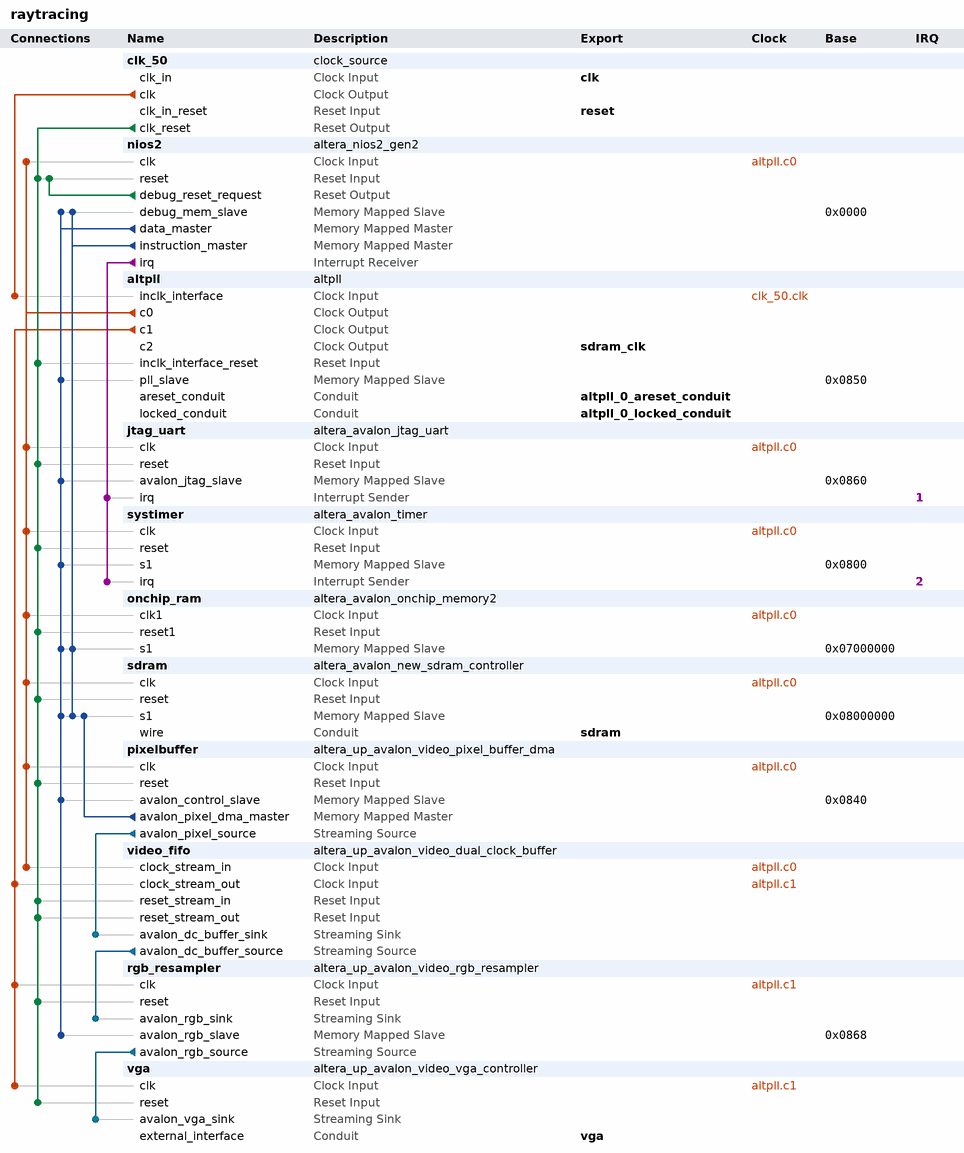
[diagram p0: system contents]
# Platform Designer (Qsys) system raytracing, Cyclone IV E EP4CE115F29C7
# Parameters at their usual value, and those the tool derives, are not listed.
package require -exact qsys 22.1
create_system raytracing
set_project_property DEVICE_FAMILY {Cyclone IV E}
set_project_property DEVICE EP4CE115F29C7

add_instance clk_50 clock_source 22.1
set_instance_parameter_value clk_50 clockFrequency 50000000

add_instance nios2 altera_nios2_gen2 22.1
set_instance_parameter_value nios2 dcache_size 16384
set_instance_parameter_value nios2 dividerType srt2
set_instance_parameter_value nios2 exceptionSlave onchip_ram.s1
set_instance_parameter_value nios2 icache_size 16384
set_instance_parameter_value nios2 impl Fast
set_instance_parameter_value nios2 resetSlave onchip_ram.s1

add_instance altpll altpll 22.1
set_instance_parameter_value altpll CLK0_DIVIDE_BY 1
set_instance_parameter_value altpll CLK0_MULTIPLY_BY 2
set_instance_parameter_value altpll CLK1_DIVIDE_BY 2
set_instance_parameter_value altpll CLK1_DUTY_CYCLE 50
set_instance_parameter_value altpll CLK1_MULTIPLY_BY 1
set_instance_parameter_value altpll CLK1_PHASE_SHIFT 0
set_instance_parameter_value altpll CLK2_DIVIDE_BY 1
set_instance_parameter_value altpll CLK2_DUTY_CYCLE 50
set_instance_parameter_value altpll CLK2_MULTIPLY_BY 2
set_instance_parameter_value altpll CLK2_PHASE_SHIFT -2500
set_instance_parameter_value altpll INCLK0_INPUT_FREQUENCY 20000
set_instance_parameter_value altpll PORT_ARESET PORT_USED
set_instance_parameter_value altpll PORT_LOCKED PORT_USED
set_instance_parameter_value altpll PORT_clk1 PORT_USED
set_instance_parameter_value altpll PORT_clk2 PORT_USED
set_instance_parameter_value altpll PORT_clk3 PORT_UNUSED

add_instance jtag_uart altera_avalon_jtag_uart 22.1
set_instance_parameter_value jtag_uart simInteractiveOptions NO_INTERACTIVE_WINDOWS

add_instance systimer altera_avalon_timer 22.1
set_instance_parameter_value systimer counterSize 64
set_instance_parameter_value systimer period 42
set_instance_parameter_value systimer periodUnits SEC

add_instance onchip_ram altera_avalon_onchip_memory2 22.1
set_instance_parameter_value onchip_ram dataWidth 32
set_instance_parameter_value onchip_ram dualPort false
set_instance_parameter_value onchip_ram initMemContent true
set_instance_parameter_value onchip_ram initializationFileName onchip_mem.hex
set_instance_parameter_value onchip_ram memorySize 16384

add_instance sdram altera_avalon_new_sdram_controller 18.1
set_instance_parameter_value sdram TAC 5.5
set_instance_parameter_value sdram TRCD 20.0
set_instance_parameter_value sdram TRP 20.0
set_instance_parameter_value sdram casLatency 3
set_instance_parameter_value sdram columnWidth 10
set_instance_parameter_value sdram dataWidth 32
set_instance_parameter_value sdram generateSimulationModel true
set_instance_parameter_value sdram model single_Micron_MT48LC4M32B2_7_chip
set_instance_parameter_value sdram numberOfBanks 4
set_instance_parameter_value sdram numberOfChipSelects 1
set_instance_parameter_value sdram powerUpDelay 100.0
set_instance_parameter_value sdram refreshPeriod 15.625
set_instance_parameter_value sdram rowWidth 13

add_instance pixelbuffer altera_up_avalon_video_pixel_buffer_dma 18.0
set_instance_parameter_value pixelbuffer addr_mode Consecutive
set_instance_parameter_value pixelbuffer back_start_address 134533120
set_instance_parameter_value pixelbuffer color_space {24-bit RGB}
set_instance_parameter_value pixelbuffer image_height 480
set_instance_parameter_value pixelbuffer image_width 640
set_instance_parameter_value pixelbuffer start_address 134217728

add_instance video_fifo altera_up_avalon_video_dual_clock_buffer 18.0
set_instance_parameter_value video_fifo color_bits 8

add_instance rgb_resampler altera_up_avalon_video_rgb_resampler 18.0
set_instance_parameter_value rgb_resampler alpha 1023
set_instance_parameter_value rgb_resampler input_type {24-bit RGB}
set_instance_parameter_value rgb_resampler output_type {30-bit RGB}

add_instance vga altera_up_avalon_video_vga_controller 18.0
set_instance_parameter_value vga board DE2-115
set_instance_parameter_value vga resolution {VGA 640x480}

# connections
add_connection altpll.c0 jtag_uart.clk clock
add_connection altpll.c0 nios2.clk clock
add_connection altpll.c0 onchip_ram.clk1 clock
add_connection altpll.c0 pixelbuffer.clk clock
add_connection altpll.c0 sdram.clk clock
add_connection altpll.c0 systimer.clk clock
add_connection altpll.c0 video_fifo.clock_stream_in clock
add_connection altpll.c1 rgb_resampler.clk clock
add_connection altpll.c1 vga.clk clock
add_connection altpll.c1 video_fifo.clock_stream_out clock
add_connection clk_50.clk altpll.inclk_interface clock
add_connection clk_50.clk_reset altpll.inclk_interface_reset reset
add_connection clk_50.clk_reset jtag_uart.reset reset
add_connection clk_50.clk_reset nios2.reset reset
add_connection clk_50.clk_reset onchip_ram.reset1 reset
add_connection clk_50.clk_reset pixelbuffer.reset reset
add_connection clk_50.clk_reset rgb_resampler.reset reset
add_connection clk_50.clk_reset sdram.reset reset
add_connection clk_50.clk_reset systimer.reset reset
add_connection clk_50.clk_reset vga.reset reset
add_connection clk_50.clk_reset video_fifo.reset_stream_in reset
add_connection clk_50.clk_reset video_fifo.reset_stream_out reset
add_connection nios2.debug_reset_request nios2.reset reset
add_connection nios2.data_master altpll.pll_slave avalon
set_connection_parameter_value nios2.data_master/altpll.pll_slave baseAddress 0x0850
add_connection nios2.data_master jtag_uart.avalon_jtag_slave avalon
set_connection_parameter_value nios2.data_master/jtag_uart.avalon_jtag_slave baseAddress 0x0860
add_connection nios2.data_master nios2.debug_mem_slave avalon
set_connection_parameter_value nios2.data_master/nios2.debug_mem_slave baseAddress 0x0000
add_connection nios2.data_master onchip_ram.s1 avalon
set_connection_parameter_value nios2.data_master/onchip_ram.s1 baseAddress 0x07000000
add_connection nios2.data_master pixelbuffer.avalon_control_slave avalon
set_connection_parameter_value nios2.data_master/pixelbuffer.avalon_control_slave baseAddress 0x0840
add_connection nios2.data_master rgb_resampler.avalon_rgb_slave avalon
set_connection_parameter_value nios2.data_master/rgb_resampler.avalon_rgb_slave baseAddress 0x0868
add_connection nios2.data_master sdram.s1 avalon
set_connection_parameter_value nios2.data_master/sdram.s1 arbitrationPriority 2
set_connection_parameter_value nios2.data_master/sdram.s1 baseAddress 0x08000000
add_connection nios2.data_master systimer.s1 avalon
set_connection_parameter_value nios2.data_master/systimer.s1 baseAddress 0x0800
add_connection nios2.instruction_master nios2.debug_mem_slave avalon
set_connection_parameter_value nios2.instruction_master/nios2.debug_mem_slave baseAddress 0x0000
add_connection nios2.instruction_master onchip_ram.s1 avalon
set_connection_parameter_value nios2.instruction_master/onchip_ram.s1 baseAddress 0x07000000
add_connection nios2.instruction_master sdram.s1 avalon
set_connection_parameter_value nios2.instruction_master/sdram.s1 arbitrationPriority 2
set_connection_parameter_value nios2.instruction_master/sdram.s1 baseAddress 0x08000000
add_connection pixelbuffer.avalon_pixel_dma_master sdram.s1 avalon
set_connection_parameter_value pixelbuffer.avalon_pixel_dma_master/sdram.s1 baseAddress 0x08000000
add_connection pixelbuffer.avalon_pixel_source video_fifo.avalon_dc_buffer_sink avalon_streaming
add_connection rgb_resampler.avalon_rgb_source vga.avalon_vga_sink avalon_streaming
add_connection video_fifo.avalon_dc_buffer_source rgb_resampler.avalon_rgb_sink avalon_streaming
add_connection nios2.irq jtag_uart.irq interrupt
set_connection_parameter_value nios2.irq/jtag_uart.irq irqNumber 1
add_connection nios2.irq systimer.irq interrupt
set_connection_parameter_value nios2.irq/systimer.irq irqNumber 2

# exported interfaces
add_interface altpll_0_areset_conduit conduit end
set_interface_property altpll_0_areset_conduit EXPORT_OF altpll.areset_conduit
add_interface altpll_0_locked_conduit conduit end
set_interface_property altpll_0_locked_conduit EXPORT_OF altpll.locked_conduit
add_interface clk clock sink
set_interface_property clk EXPORT_OF clk_50.clk_in
add_interface reset reset sink
set_interface_property reset EXPORT_OF clk_50.clk_in_reset
add_interface sdram conduit end
set_interface_property sdram EXPORT_OF sdram.wire
add_interface sdram_clk clock source
set_interface_property sdram_clk EXPORT_OF altpll.c2
add_interface vga conduit end
set_interface_property vga EXPORT_OF vga.external_interface

set_interconnect_requirement {$system} qsys_mm.clockCrossingAdapter HANDSHAKE
set_interconnect_requirement {$system} qsys_mm.enableEccProtection FALSE
set_interconnect_requirement {$system} qsys_mm.insertDefaultSlave FALSE
set_interconnect_requirement {$system} qsys_mm.maxAdditionalLatency 1

save_system raytracing.qsys
